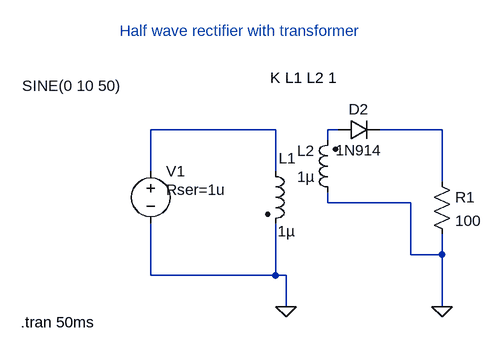
[diagram p0: schematic Half Wave Rectifier with tranfromer.asc]
Half Wave Rectifier with tranfromer.asc, the LTspice schematic file:
Version 4
SHEET 1 880 680
WIRE 192 48 0 48
WIRE 288 48 272 48
WIRE 448 48 352 48
WIRE 272 64 272 48
WIRE 0 112 0 48
WIRE 192 112 192 48
WIRE 448 128 448 48
WIRE 272 160 272 144
WIRE 400 160 272 160
WIRE 400 240 400 160
WIRE 448 240 448 208
WIRE 448 240 400 240
WIRE 0 272 0 192
WIRE 192 272 192 192
WIRE 192 272 0 272
WIRE 208 272 192 272
WIRE 208 320 208 272
WIRE 448 320 448 240
FLAG 208 320 0
FLAG 448 320 0
SYMBOL res 432 112 R0
SYMATTR InstName R1
SYMATTR Value 100
SYMBOL ind2 176 96 R0
WINDOW 0 21 -4 Left 2
WINDOW 3 19 108 Left 2
SYMATTR InstName L1
SYMATTR Value 1µ
SYMATTR Type ind
SYMBOL ind2 288 160 R180
WINDOW 0 36 80 Left 2
WINDOW 3 36 40 Left 2
SYMATTR InstName L2
SYMATTR Value 1µ
SYMATTR Type ind
SYMBOL diode 288 64 R270
WINDOW 0 32 32 VTop 2
WINDOW 3 0 32 VBottom 2
SYMATTR InstName D2
SYMATTR Value 1N914
SYMBOL voltage 0 96 R0
WINDOW 3 -198 -116 Left 2
WINDOW 123 0 0 Left 0
WINDOW 39 24 44 Left 2
SYMATTR InstName V1
SYMATTR Value SINE(0 10 50)
SYMATTR SpiceLine Rser=1u
TEXT 184 -32 Left 2 !K L1 L2 1
TEXT -200 344 Left 2 !.tran 50ms
TEXT -48 -104 Left 2 ;Half wave rectifier with transformer

The netlist it stands for:
* Half Wave Rectifier with tranfromer.asc
R1 N003 0 100
L1 N001 0 1µ
L2 0 N002 1µ
D2 N002 N003 1N914
V1 N001 0 SINE(0 10 50) Rser=1u
.model D D
.lib standard.dio
K L1 L2 1
.tran 50ms
* Half wave rectifier with transformer
.backanno
.end